# EAGLE design sensors (EAGLE 7.7.0)
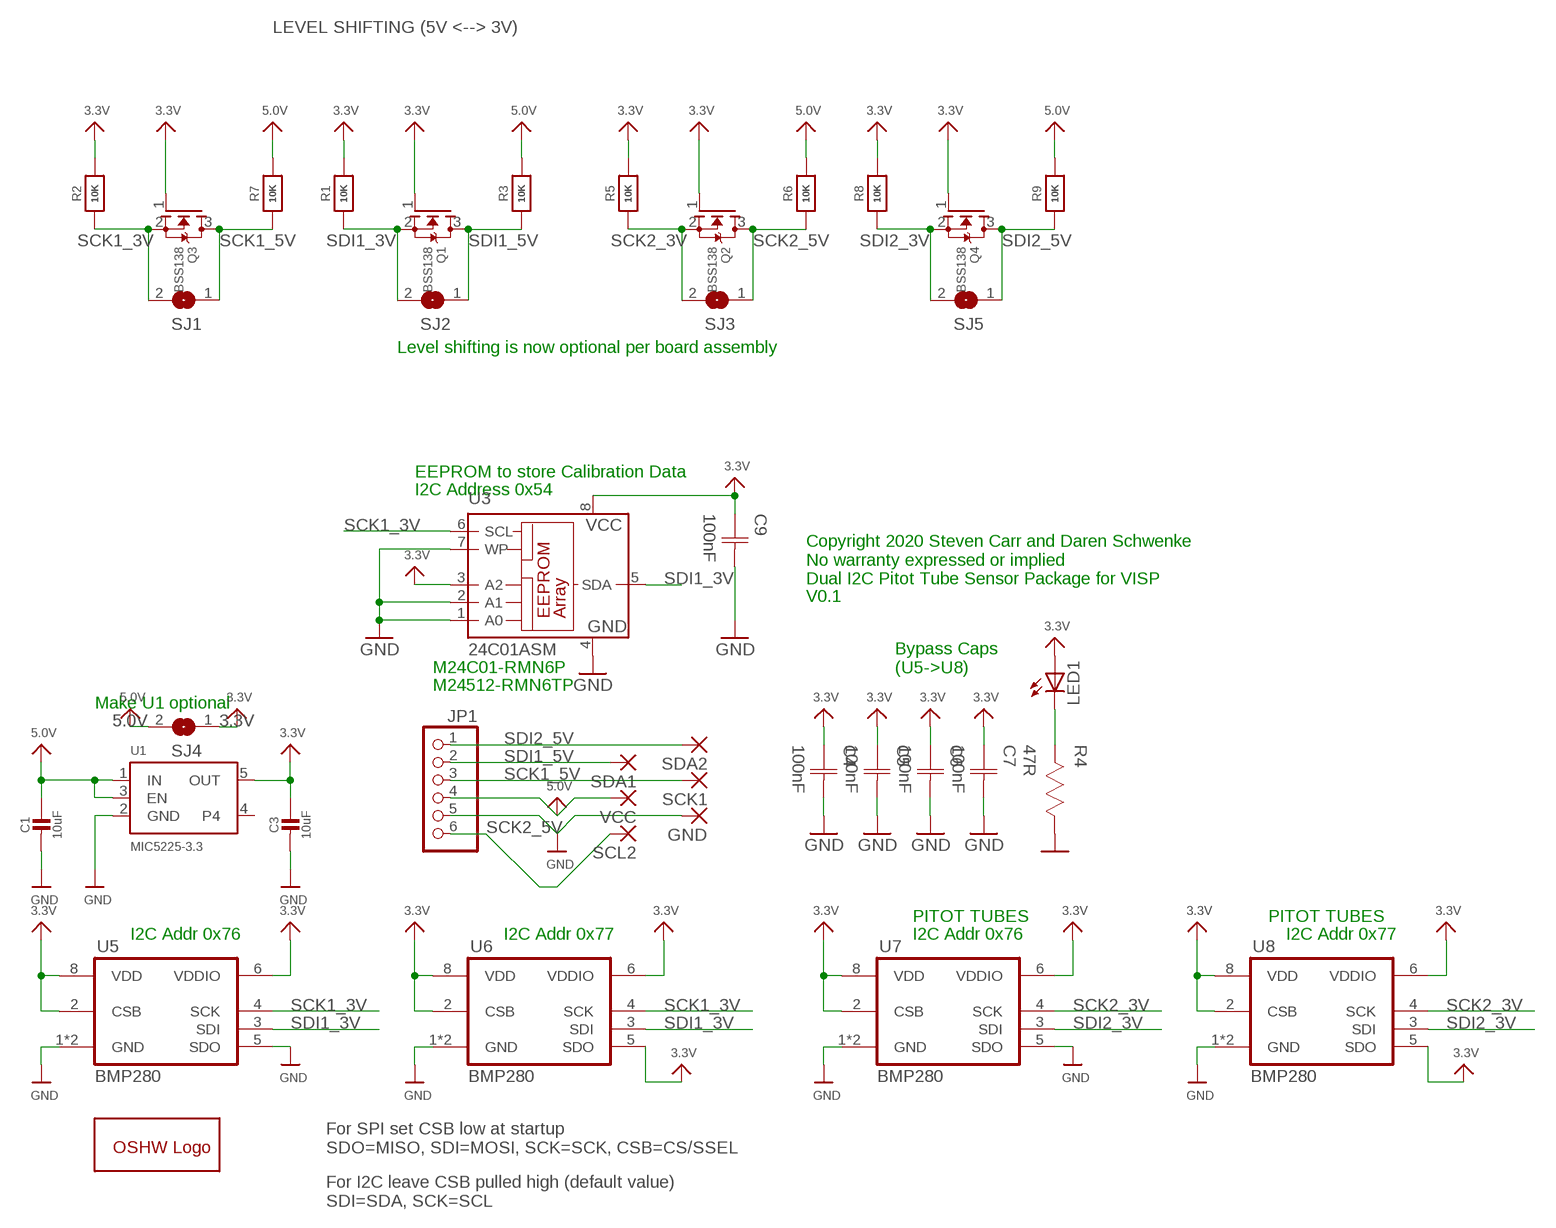
[diagram p0: schematic, sheet 1]

## Parts
C1  10uF  CAP_CERAMIC_0805  [_0805]
C3  10uF  CAP_CERAMIC_0805  [_0805]
C4  100nF  CAPACITOR-0402  [CAP0402]
C5  100nF  CAPACITOR-0402  [CAP0402]
C6  100nF  CAPACITOR-0402  [CAP0402]
C7  100nF  CAPACITOR-0402  [CAP0402]
C9  100nF  CAPACITOR-0402  [CAP0402]
GND  SMD2  [SMD1,27-2,54]
GOLD_ORB_SM1  OSHWLOGOLOGO8MM  [OSHW_8MM]
JP1  PINHD-1X6  [1X06]
LED1  LEDCHIP-LED0603  [CHIP-LED0603]
Q1  BSS138  MOSFET-NWIDE  [SOT23-WIDE]
Q2  BSS138  MOSFET-NWIDE  [SOT23-WIDE]
Q3  BSS138  MOSFET-NWIDE  [SOT23-WIDE]
Q4  BSS138  MOSFET-NWIDE  [SOT23-WIDE]
R1  10K  RESISTOR_0402  [_0402]
R2  10K  RESISTOR_0402  [_0402]
R3  10K  RESISTOR_0402  [_0402]
R4  47R  RESISTOR-0402  [RES0402]
R5  10K  RESISTOR_0402  [_0402]
R6  10K  RESISTOR_0402  [_0402]
R7  10K  RESISTOR_0402  [_0402]
R8  10K  RESISTOR_0402  [_0402]
R9  10K  RESISTOR_0402  [_0402]
SCK1  SMD2  [SMD1,27-2,54]
SCL2  SMD2  [SMD1,27-2,54]
SDA1  SMD2  [SMD1,27-2,54]
SDA2  SMD2  [SMD1,27-2,54]
SJ1  SJ  [SJ]
SJ2  SJ  [SJ]
SJ3  SJ  [SJ]
SJ4  SJ  [SJ]
SJ5  SJ  [SJ]
U1  MIC5225-3.3  VREG_SOT23-5  [SOT23-5]
U3  24C01ASM  [SO-08M]
U5  BMP280  [BMP280]
U6  BMP280  [BMP280]
U7  BMP280  [BMP280]
U8  BMP280  [BMP280]
VCC  SMD2  [SMD1,27-2,54]

## Nets
3.3V: C3.1 C4.1(C1) C5.1(C1) C6.1(C1) C7.1(C1) C9.1(C1) LED1.A Q1.1(G) Q2.1(G) Q3.1(G) Q4.1(G) R1.2 R2.2 R5.2 R8.2 SJ4.1 U1.5(OUT) U3.3(A2) U3.8(VCC) U5.2(CSB) U5.6(VDDIO) U5.8(VDD) U6.2(CSB) U6.5(SDO) U6.6(VDDIO) U6.8(VDD) U7.2(CSB) U7.6(VDDIO) U7.8(VDD) U8.2(CSB) U8.5(SDO) U8.6(VDDIO) U8.8(VDD)
5.0V: C1.1 JP1.4 R3.2 R6.2 R7.2 R9.2 SJ4.2 U1.1(IN) U1.3(EN) VCC.1(P)
GND: C1.2 C3.2 C4.2(C2) C5.2(C2) C6.2(C2) C7.2(C2) C9.2(C2) GND.1(P) JP1.5 R4.1 U1.2(GND) U3.1(A0) U3.2(A1) U3.4(GND) U3.7(WP) U5.1(GND) U5.5(SDO) U5.7(GND) U6.1(GND) U6.7(GND) U7.1(GND) U7.5(SDO) U7.7(GND) U8.1(GND) U8.7(GND)
LED: LED1.C R4.2
SCK1_3V: Q3.2(S) R2.1 SJ1.2 U3.6(SCL) U5.4(SCK) U6.4(SCK)
SCK1_5V: JP1.3 Q3.3(D) R7.1 SCK1.1(P) SJ1.1
SCK2_3V: Q2.2(S) R5.1 SJ3.2 U7.4(SCK) U8.4(SCK)
SCK2_5V: JP1.6 Q2.3(D) R6.1 SCL2.1(P) SJ3.1
SDI1_3V: Q1.2(S) R1.1 SJ2.2 U3.5(SDA) U5.3(SDI) U6.3(SDI)
SDI1_5V: JP1.2 Q1.3(D) R3.1 SDA1.1(P) SJ2.1
SDI2_3V: Q4.2(S) R8.1 SJ5.2 U7.3(SDI) U8.3(SDI)
SDI2_5V: JP1.1 Q4.3(D) R9.1 SDA2.1(P) SJ5.1
Unconnected: U1.4

## Notes on the sheet
- LEVEL SHIFTING (5V <--> 3V)
- Level shifting is now optional per board assembly
- EEPROM to store Calibration Data
- I2C Address 0x54
- Copyright 2020 Steven Carr and Daren Schwenke
  No warranty expressed or implied
  Dual I2C Pitot Tube Sensor Package for VISP
- V0.1
- M24C01-RMN6P
- Bypass Caps
  (U5->U8)
- M24512-RMN6TP
- Make U1 optional
- PITOT TUBES | PITOT TUBES
- I2C Addr 0x76 | I2C Addr 0x77 | I2C Addr 0x76 | I2C Addr 0x77
- For SPI set CSB low at startup
  SDO=MISO, SDI=MOSI, SCK=SCK, CSB=CS/SSEL
- For I2C leave CSB pulled high (default value)
  SDI=SDA, SCK=SCL

## Library data of the parts
C1 C3 = microbuilder:CAP_CERAMIC: Ceramic Capacitors For new designs, use the packages preceded by an '_' character since they are more reliable: The following footprints should be used on most boards: _0402 - Standard footprint for regular board layouts _0603 - Standard footprint for regular board layouts _0805 - Standard footprint for regular board layouts _1206 - Standard footprint for regular board layouts For extremely tight-pitch boards where space is at a premium, the following 'micro-pitch' footprints can be used (smaller pads, no silkscreen outline, etc.): _0402MP - Micro-pitch footprint for very dense/compact boards _0603MP - Micro-pitch footprint for very dense/compact boards _0805MP - Micro-pitch footprint for very dense/compact boards _1206MP - Micro-pitch footprint for very dense/compact boards; MPN: C1608X5R1A106M080AC
C4-C7 = Capacitor:CAPACITOR; MPN: CL10F104ZO8NNNC
C9 = Capacitor:CAPACITOR; MPN: CL10B104KB8NNNC
GND SCK1 SCL2 SDA1 SDA2 VCC = wirepad:SMD2: SMD PAD
GOLD_ORB_SM1 = oshw:OSHWLOGO: The OSHW logo for PCB layout
JP1 = pinhead:PINHD-1X6: PIN HEADER
LED1 = led:LED: LED OSRAM: - CHIPLED LG R971, LG N971, LY N971, LG Q971, LY Q971, LO R971, LY R971 LH N974, LH R974 LS Q976, LO Q976, LY Q976 LO Q996 - Hyper CHIPLED LW Q18S LB Q993, LB Q99A, LB R99A - SideLED LS A670, LO A670, LY A670, LG A670, LP A670 LB A673, LV A673, LT A673, LW A673 LH A674 LY A675 LS A676, LA A676, LO A676, LY A676, LW A676 LS A679, LY A679, LG A679 - Hyper Micro SIDELED® LS Y876, LA Y876, LO Y876, LY Y876 LT Y87S - SmartLED LW L88C, LW L88S LB L89C, LB L89S, LG L890 LS L89K, LO L89K, LY L89K LS L896, LA L896, LO L896, LY L896 - TOPLED LS T670, LO T670, LY T670, LG T670, LP T670 LSG T670, LSP T670, LSY T670, LOP T670, LYG T670 LG T671, LOG T671, LSG T671 LB T673, LV T673, LT T673, LW T673 LH T674 LS T676, LA T676, LO T676, LY T676, LB T676, LH T676, LSB T676, LW T676 LB T67C, LV T67C, LT T67C, LS T67K, LO T67K, LY T67K, LW E67C LS E67B, LA E67B, LO E67B, LY E67B, LB E67C, LV E67C, LT E67C LW T67C LS T679, LY T679, LG T679 LS T770, LO T770, LY T770, LG T770, LP T770 LB T773, LV T773, LT T773, LW T773 LH T774 LS E675, LA E675, LY E675, LS T675 LS T776, LA T776, LO T776, LY T776, LB T776 LHGB T686 LT T68C, LB T68C - Hyper Mini TOPLED® LB M676 - Mini TOPLED Santana® LG M470 LS M47K, LO M47K, LY M47K Source: http://www.osram.convergy.de LUXEON: - LUMILED® LXK2-PW12-R00, LXK2-PW12-S00, LXK2-PW14-U00, LXK2-PW14-V00 LXK2-PM12-R00, LXK2-PM12-S00, LXK2-PM14-U00 LXK2-PE12-Q00, LXK2-PE12-R00, LXK2-PE12-S00, LXK2-PE14-T00, LXK2-PE14-U00 LXK2-PB12-K00, LXK2-PB12-L00, LXK2-PB12-M00, LXK2-PB14-N00, LXK2-PB14-P00, LXK2-PB14-Q00 LXK2-PR12-L00, LXK2-PR12-M00, LXK2-PR14-Q00, LXK2-PR14-R00 LXK2-PD12-Q00, LXK2-PD12-R00, LXK2-PD12-S00 LXK2-PH12-R00, LXK2-PH12-S00 LXK2-PL12-P00, LXK2-PL12-Q00, LXK2-PL12-R00 Source: www.luxeon.com KINGBRIGHT: KA-3528ASYC Source: www.kingbright.com; MPN: SML-D12P8WT86
Q1-Q4 = microbuilder:MOSFET-N: N-Channel Mosfet LEGEND VDS: Voltage Drain-Source ID: Drain Current RDS(ON): Drain-Source On-State Resistance VGS(TH): Gate-Source Threshold Voltage CISS: Drain-Source Input Capacitance SOT-23 Name VDS ID RDS(ON) VGS(TH) CISS Order Number 2N7002E 60V 260mA 2.5 Ohm 2.5V @ 250uA 26.7pF @ 25V 2N7002ET1GOSTR-ND BSH103 30V 850mA 400 mOhm 400mV @ 1mA 83pF @ 24V BSH103,235-ND BSS138 60V 320mA 1.6 Ohm 1.5V @ 250uA 50pF @ 10V Mouser: 771-BSS138PW115 DMN2075U-7 20V 4.2A 38 mOhm 1V @ 250 uA 594.3pF @ 10V DMN2075U-7DICT-ND * BSS138 good choice for I2C level-shifting POWERPAK 1212-8 Name VDS ID RDS(ON) VGS(TH) CISS Order Number Si7308DN 60V 6A 58 mOhm 3V @ 250uA 665pF @ 15V SI7308DN-T1-E3CT-ND
R1-R3 R5-R9 = microbuilder:RESISTOR: Resistors For new designs, use the packages preceded by an '_' character since they are more reliable: The following footprints should be used on most boards: _0402 - Standard footprint for regular board layouts _0603 - Standard footprint for regular board layouts _0805 - Standard footprint for regular board layouts _1206 - Standard footprint for regular board layouts For extremely tight-pitch boards where space is at a premium, the following 'micro-pitch' footprints can be used (smaller pads, no silkscreen outline, etc.): _0402MP - Micro-pitch footprint for very dense/compact boards _0603MP - Micro-pitch footprint for very dense/compact boards _0805MP - Micro-pitch footprint for very dense/compact boards _1206MP - Micro-pitch footprint for very dense/compact boards
R4 = Resistor:RESISTOR; MPN: RC0603FR-0747RL
SJ1-SJ5 = jumper:SJ: SMD solder JUMPER
U1 = microbuilder:VREG_SOT23-5: SOT23-5 Fixed Voltage Regulators Part Current Out V Out V In V Dropout θJA (°C/W) TJ (°C) Digikey Part No. ADP121 150mA 3.3V 3.4-5.5V 0.09V @ 150mA -- -- ADP121-AUJZ33R7CT-ND ADP121 150mA 3.0V 3.1-5.5V 0.09V @ 150mA -- -- ADP121-AUJZ30R7CT-ND ADP122 300mA 3.3V 3.4-5.5V 0.085V @ 300mA -- -- ADP122AUJZ-3.3-R7CT-ND ADP1712 300mA 3.3V 3.5-5.5V 0.17V @ 300mA -- -- ADP1712AUJZ-3.3-R7TR-ND AP7311 (Low Cost) 150mA 3.3V 3.5-6V 0.15V @ 150mA -- -- AP7311-33WG-7DICT-ND LD39015M18R 150mA 1.8V 1.9V-5.5V 0.08V @ 100mA -- -- 497-6977-1-ND LP2985A-33DBVR 150mA 3.3V 3.3-16V 0.28V @ 150mA 206 150 296-18479-1-ND MCP1824T-3302E/OT 300mA 3.3V 3.5V-6V 0.2V @ 300mA -- -- MCP1824T-3302E/OTCT-ND MIC5205-2.5YM5 TR 150mA 2.5V 2.7-16V 0.165V @ 150mA -- -- 576-1257-2-ND MIC5205-3.0YM5 TR 150mA 3.0V 3.2V-16V 0.165V @ 150mA -- -- 576-1258-2-ND MIC5205-3.3YM5 TR 150mA 3.3V 3.5V-16V 0.165V @ 150mA -- -- 576-1259-2-ND TPS780330220 150mA 3.3V+2.2V 3.6-5.5V 250mV Max -- -- 296-23332-1-ND TDA3663/N1,135 100mA 3.3V 3.5-45V 0.18V @ 50mA -- -- 568-5343-1-ND Max operating temp can be calculated using θJA, TJ (max junction temperature), and power in watts. Set the "Maximum Ambient Temperature" until it reaches TJ ("Max Junction Temperature"), which is the absolute limit for safe use of the regulator: Heat Sink Temperature Calculator <http://www.daycounter.com/Calculators/Heat-Sink-Temperature-Calculator.phtml> For example, With 12V source into a 3.3V LP2985 and a 30mA load, we are dissipating (12V-3.3V) * 0.03A = 0.261W. With a θJA of 206 °C/W, a TJ of 150°C, and 261mW we can safely use the chip without a heat sink up to 75°C (=147.1°C Junction Temperature).; MPN: MIC5225-3.3YM5-TR
U3 = microchip:24*: Serial EEPROM I2C; MF: MICROCHIP; MPN: M24C01-RMN6P
U5-U8 = bosch-bmp280:BMP280: The BMP280 is an absolute barometric pressure sensor especially designed for mobile applications. The sensor module is housed in an extremely compact 8-pin metal-lid LGA package with a footprint of only 2.0 × 2.5 mm2 and 0.95 mm package height. Its small dimensions and its low power consumption of 2.7 μA @1Hz allow the implementation in battery driven devices such as mobile phones, GPS modules or watches. The library has been designed by Richard Magdycz <https://www.facebook.com/groups/eaglecadsoftUK>; MPN: BMP280

## Board
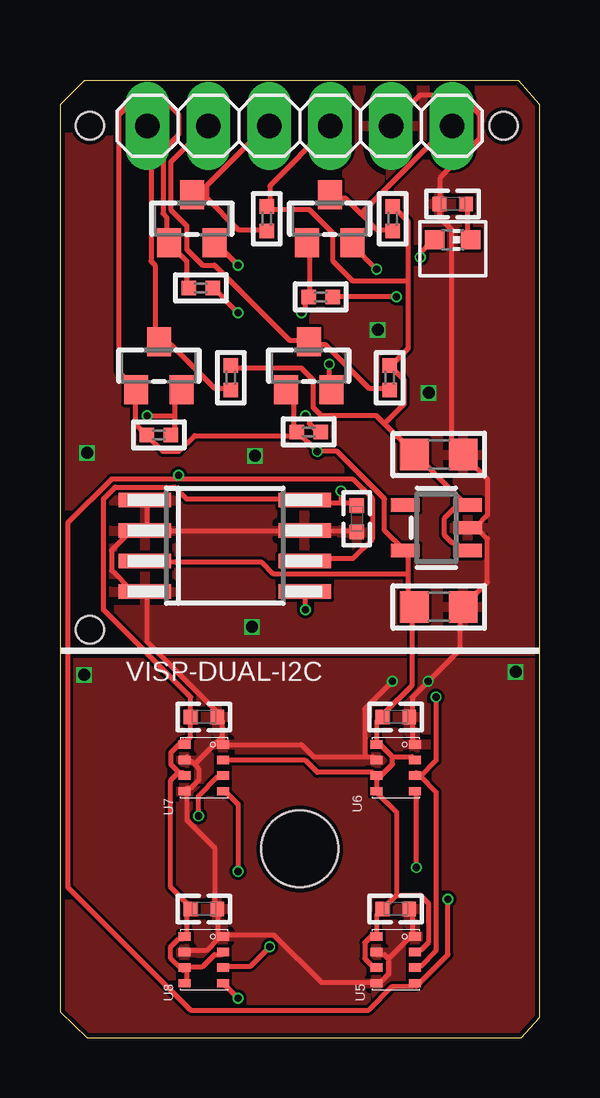
[diagram p1: board, top side]
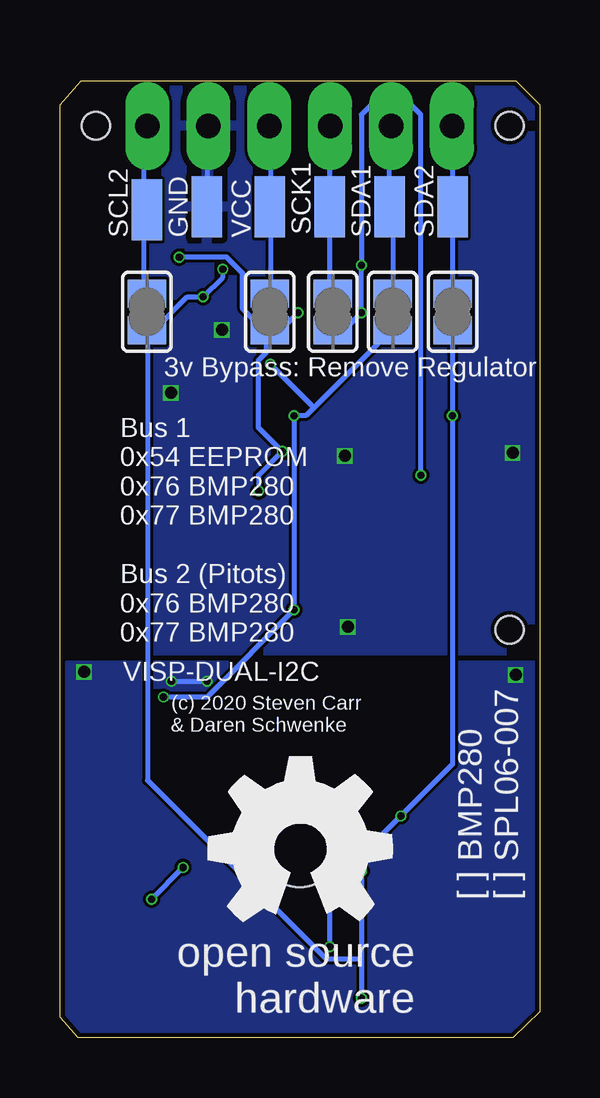
[diagram p2: board, bottom side, seen from below]

Size 20 x 39.88 mm. Coordinates in mm from the lower left corner, seen from the top.
Outline: 1,39.88 0,38.88 0,1.08 1.12,0 19.23,0 20,0.85 20,38.88 19.12,39.88 1,39.88
Copper layers (1*16): Top 0.035mm / dielectric 1.6mm / Bottom 0.035mm
Design rules "jlcpcb-2layers *": minimum track width 8mil, minimum drill 0.3mm, track to track 5mil, track to pad 5mil, pad to pad 5mil, via to via 5mil, smd to smd 5mil, copper to edge 0.2mm, drill to drill 6mil, minimum pad ring 10mil, minimum via ring 3mil, stop-mask expansion 4mil, vias tented up to drill 0mil, thermal gap 10mil
Holes 3.2 mm at 10,7.88
Holes 1.15 mm at 18.5,38 1.25,17 1.25,38
vRestrict: area 4.8,2.8 to 7.2,5.2; area 12.8,2.8 to 15.2,5.2; area 4.8,10.8 to 7.2,13.2; area 12.8,10.8 to 15.2,13.2

### Footprints (pad centres in the part's own frame; a part is rotated, then mirrored left to right if it is on the bottom)
_0805 = smd 1.2 x 1.3: 1 -1.016,0; 2 1.016,0
CAP0402 = smd 0.6 x 0.6: 1 -0.55,0; 2 0.55,0
SMD1,27-2,54 = smd 1.27 x 2.54: 1 0,0
1X06 = drill 1.016 long: 1 -6.35,0; 2 -3.81,0; 3 -1.27,0; 4 1.27,0; 5 3.81,0; 6 6.35,0
CHIP-LED0603 = smd 0.8 x 0.8: A 0,-0.75; C 0,0.75
SOT23-WIDE = smd 1 x 1.2: 1 -0.95,-1; 2 0.95,-1; 3 0,1
_0402 = smd 0.6 x 0.6: 1 -0.508,0; 2 0.508,0
RES0402 = smd 0.6 x 0.6: 1 -0.55,0; 2 0.55,0
SJ = smd 1.168 x 1.6: 1 -0.762,0; 2 0.762,0
SOT23-5 = smd 0.55 x 1.2: 1 -0.95,-1.3; 2 0,-1.3; 3 0.95,-1.3; 4 0.95,1.3; 5 -0.95,1.3
SO-08M = smd 0.6 x 2.2: 1 -1.905,-3.33; 2 -0.635,-3.33; 3 0.635,-3.33; 4 1.905,-3.33; 5 1.905,3.33; 6 0.635,3.33; 7 -0.635,3.33; 8 -1.905,3.33
BMP280 = smd 0.35 x 0.5: 1 0.975,-0.8; 2 0.325,-0.8; 3 -0.325,-0.8; 4 -0.975,-0.8; 5 -0.975,0.8; 6 -0.325,0.8; 7 0.325,0.8; 8 0.975,0.8

### Placement (x,y rotation side)
C1  15.8,24.3 0 top
C3  15.8,17.95 0 top
C4  6,13.38 0 top
C5  14,5.38 0 top
C6  6,5.38 0 top
C7  14,13.38 0 top
C9  12.38,21.62 270 top
GND  13.88,34.62 0 bottom
GOLD_ORB_SM1  10,7.88 0 bottom
JP1  10,38 0 top
LED1  16.38,33.25 270 top
Q1  10.38,28 0 top
Q2  11.25,34.12 0 top
Q3  5.5,34.12 0 top
Q4  4.12,28 0 top
R1  10.38,25.25 180 top
R2  5.88,31.25 180 top
R3  13.75,27.5 90 top
R4  16.38,34.75 0 top
R5  10.88,30.88 180 top
R6  13.88,34.12 90 top
R7  8.62,34.12 90 top
R8  4.12,25.12 180 top
R9  7.12,27.5 90 top
SCK1  8.75,34.62 0 bottom
SCL2  16.38,34.5 0 bottom
SDA1  6.25,34.62 0 bottom
SDA2  3.62,34.62 0 bottom
SJ1  8.62,30.25 270 bottom
SJ2  6.12,30.25 270 bottom
SJ3  16.38,30.25 270 bottom
SJ4  11.25,30.25 90 bottom
SJ5  3.62,30.25 270 bottom
U1  15.7,21.25 90 top
U3  6.88,20.5 270 top
U5  14,3.25 90 top
U6  14,11.25 90 top
U7  6,11.25 90 top
U8  6,3.25 90 top
VCC  11.25,34.62 0 bottom

### Tracks (layer width: path | path; a pad name or v marks a point on that pad's centre or on a via)
3.3V  (via drill 0.3)
  Top 0.203: 11.72,22.29 10.24,22.29 U3.8 10.07,22.45 5.28,22.45 4.79,22.95 2.31,22.95 1.82,22.45 1.82,17.83 5.45,14.2 5.45,13.54 C4.1 5.45,12.55 5.28,12.38 U7.8 5.12,12.38 4.62,11.89 4.62,11.39 4.95,11.06 | 11.72,22.29 12.22,22.29 C9.1 | 4.95,11.06 5.12,11.06 U7.6 4.95,11.06 | U8.5 5.28,2.31 5.28,2.81 U8.6 | U8.2 6.77,3.47 6.44,3.47 5.94,2.97 5.28,2.97 U8.6 | U8.6 5.12,2.81 4.62,3.3 4.62,3.8 4.95,4.13 5.12,4.13 U8.8 5.28,4.29 5.28,5.12 5.45,5.28 C6.1 5.45,5.45 4.62,6.27 4.62,10.73 4.95,11.06 | Q2.1 10.4,33.02 10.4,31.04 R5.2 10.24,30.87 10.24,30.38 v10.07,30.21 | v15.02,32.52 15.02,32.69 15.52,33.19 LED1.A | R2.2 5.28,31.37 5.28,32.36 4.62,33.02 Q3.1 4.46,33.19 4.46,34.18 4.29,34.34 4.29,36.98 4.95,37.64 4.95,38.47 4.13,39.29 3.3,39.29 2.48,38.47 2.48,27.74 3.14,27.08 Q4.1 3.14,26.91 3.14,25.59 3.47,25.26 R8.2 3.63,25.09 4.29,24.43 4.95,24.43 5.61,25.09 9.74,25.09 R1.2 | R1.2 9.74,25.26 9.74,26.75 9.58,26.91 Q1.1 | R1.2 9.91,25.26 v10.73,24.43 11.56,24.43 13.54,22.45 13.54,21.13 14.36,20.31 U1.5 14.53,20.14 14.53,19.32 | 14.53,19.32 14.53,18.16 14.69,18 C3.1 14.69,17.83 14.69,14.69 13.54,13.54 C7.1 13.37,13.37 13.21,13.21 13.21,12.38 | U5.6 13.04,2.97 12.71,3.3 12.71,3.96 13.04,4.29 U5.8 13.21,4.29 13.21,5.12 13.37,5.28 C5.1 13.54,5.45 14.03,5.94 | 14.03,5.94 15.02,5.94 15.35,5.61 15.35,3.96 15.02,3.63 14.86,3.63 U5.2 | 13.87,11.72 14.69,11.72 U6.2 | 13.21,12.38 13.87,11.72 | 13.21,12.38 U6.8 | 13.21,10.73 13.21,10.9 U6.6 13.04,11.06 10.73,11.06 10.24,11.56 6.93,11.56 U7.2 | 13.21,10.73 13.21,10.4 U6.5 13.21,10.24 14.03,9.41 14.03,5.94 | 13.87,11.72 13.87,11.39 13.21,10.73
  Top 0.203: 14.53,19.32 8.91,19.32 8.42,19.81 3.63,19.81 U3.3 | v11.72,22.78 11.72,22.29
  Bottom 0.203: v15.02,32.52 13.04,32.52 12.38,31.86 12.38,30.38 11.39,29.39 | v10.07,30.21 10.73,29.55 11.23,29.55 SJ4.1 11.39,29.39 | 11.39,29.39 11.39,28.56 11.72,28.23 11.72,25.43 v10.73,24.43 11.72,23.44 v11.72,22.78
5.0V
  Top 0.203: JP1.4 11.23,37.97 8.75,35.5 8.75,34.67 R7.2 8.75,34.51 10.4,34.51 11.39,33.52 11.39,32.36 12.22,31.53 14.53,31.53 | U1.1 16.84,20.31 16.51,20.64 16.34,20.64 16.02,20.97 16.02,21.63 16.51,22.12 16.84,22.12 U1.3 16.84,22.29 14.86,24.27 C1.1 14.69,24.43 13.54,25.59 | 13.54,25.59 13.21,25.92 10.9,25.92 10.57,26.25 10.57,27.41 10.07,27.9 7.26,27.9 R9.2 | 13.54,25.59 14.36,26.42 14.36,27.41 13.87,27.9 R3.2 13.87,28.07 14.53,28.73 14.53,31.53 | 14.53,31.53 14.53,34.01 14.03,34.51 R6.2
  Bottom 0.203: SJ4.2 11.23,31.04 11.23,34.51 VCC.1 11.23,34.67 11.23,37.97 JP1.4
GND  (via drill 0.3, 0.5 pad 0.25)
  Top 0.203: C9.2 12.22,21.13 10.24,21.13 U3.7 10.07,21.13 3.63,21.13 U3.2 | U3.2 3.47,21.13 2.97,21.13 2.15,20.31 2.15,19.48 2.97,18.66 3.47,18.66 U3.4 3.63,18.49 3.63,16.51 6.6,13.54 C4.2 6.6,13.37 6.77,13.21 6.77,12.55 | U3.1 3.63,22.29 3.63,21.3 U3.2 | 13.7,3.3 13.7,2.64 13.37,2.31 13.21,2.31 U5.5 13.04,2.31 10.9,2.31 8.91,4.29 6.93,4.29 U8.1 | 13.7,3.3 13.54,3.47 13.21,3.47 U5.7 | 14.69,4.29 14.69,5.28 C5.2 | 14.69,4.29 13.7,3.3 | 14.69,4.29 U5.1 | 6.6,4.13 6.77,4.29 U8.1 | 6.6,4.13 6.11,3.63 5.28,3.63 U8.7 | 6.6,4.13 6.6,5.28 C6.2 6.44,5.45 6.44,7.92 5.28,9.08 5.28,10.24 U7.5 5.28,10.4 5.45,10.4 5.78,10.73 5.78,11.23 5.61,11.39 | 6.6,4.13 U8.1 | 5.61,11.39 5.28,11.72 U7.7 | 6.77,12.55 6.77,12.38 U7.1 6.93,12.22 10.07,12.22 10.57,11.72 12.71,11.72 | 12.71,11.72 13.04,11.72 U6.7 | 6.77,12.55 5.61,11.39 | JP1.5 13.87,38.14 15.02,39.29 16.68,39.29 17.5,38.47 17.5,37.48 15.85,35.83 15.85,34.84 R4.1 15.85,34.67 15.85,34.18 16.34,33.68 16.34,24.77 16.68,24.43 C1.2 16.84,24.27 17.83,23.28 17.83,21.79 17.34,21.3 | 17.34,21.3 17,21.3 U1.2 17.34,21.3 | U6.1 14.69,12.38 14.69,13.37 C7.2 14.69,13.54 14.69,14.2 v15.35,14.86 16.68,16.18 16.68,17.83 C3.2 16.84,18 17.83,18.99 17.83,20.8 17.34,21.3 | 12.71,11.72 12.71,13.7 v13.87,14.86
  Bottom 0.203: GND.1 13.87,34.67 13.87,37.97 JP1.5 | v15.35,14.86 v13.87,14.86
  other vias: 19,15.25 1,15.12 8,17.12 8.12,24.25 1.12,24.38 15.38,26.88 13.25,29.5
  pour Top: 0,38.75 0,16.12 19.88,16.12 19.88,39 19.12,39.75 0.88,39.75 0.88,39.62
  pour Bottom: 0,38.88 0,16.12 19.88,16.12 19.88,39.12 19.25,39.75 0.88,39.75
  pour Bottom: 0,15.5 19.75,15.5 19.75,0.62 19.25,0.12 0.75,0.12 0,0.88
  pour Top: 0,15.62 19.88,15.62 19.88,0.75 19.25,0.12 0.88,0.12 0,1
LED
  Top 0.203: R4.2 17,34.67 17,33.35 LED1.C
SCK1_3V  (via drill 0.3)
  Top 0.203: v7.43,30.21 6.44,31.2 R2.1 | v7.43,32.19 6.6,33.02 Q3.2 | 4.95,23.28 12.22,23.28 13.04,22.45 13.04,20.8 12.22,19.98 10.24,19.98 U3.6 | 4.95,23.28 2.15,23.28 0.33,21.46 0.33,6.27 5.45,1.16 12.88,1.16 13.87,2.15 14.69,2.15 U5.4 14.86,2.15 16.18,3.47 v16.18,5.78 | v14.86,7.1 14.86,10.24 U6.4 | 4.95,23.28 v4.95,23.44
  Bottom 0.203: SJ1.2 8.59,29.55 8.09,29.55 v7.43,30.21 v7.43,32.19 7.43,38.47 6.6,39.29 5.78,39.29 4.95,38.47 v4.95,23.44 | v16.18,5.78 v14.86,7.1
SCK1_5V
  Top 0.203: 6.11,35 7.43,33.68 8.59,33.68 R7.1 | 6.11,35 5.61,35 Q3.3 | 6.11,35 6.11,35.5 8.59,37.97 JP1.3
  Bottom 0.203: SJ1.1 8.75,31.04 8.75,34.51 SCK1.1 8.75,34.67 8.75,37.97 JP1.3
SCK2_3V  (via drill 0.3)
  Top 0.203: v7.43,1.65 6.93,2.15 U8.4 | v7.43,6.93 7.43,9.74 6.93,10.24 U7.4 | v14.03,30.87 11.39,30.87 R5.1 | v13.21,32.03 12.22,33.02 Q2.2
  Bottom 0.203: v7.43,6.93 7.43,3.3 | 7.43,3.3 v7.43,1.65 | v13.21,32.03 13.21,31.7 v14.03,30.87 14.69,30.87 16.02,29.55 16.34,29.55 SJ3.2 16.34,29.39 16.34,10.73 8.91,3.3 7.43,3.3
SCK2_5V
  Top 0.203: 12.55,34.34 11.89,35 11.39,35 Q2.3 | 12.55,34.34 13.21,33.68 13.87,33.68 R6.1 | 12.55,34.34 16.34,38.14 JP1.6
  Bottom 0.203: SJ3.1 16.51,31.04 16.51,34.34 SCL2.1 16.51,34.51 16.51,37.97 JP1.6
SDI1_3V  (via drill 0.3)
  Top 0.203: 15.02,10.9 14.86,11.06 U6.3 15.02,10.9 | 15.02,10.9 15.68,10.24 15.68,3.63 15.02,2.97 14.86,2.97 U5.3 | v10.24,25.92 10.4,25.76 10.4,25.59 10.73,25.26 R1.1 | v11.23,28.07 11.23,27.08 Q1.2 | v10.24,17.83 10.24,18.49 U3.5 | 15.02,10.9 15.68,11.56 v15.68,14.2
  Bottom 0.203: 9.41,26.25 6.27,29.39 SJ2.2 | 9.41,26.25 9.74,25.92 v10.24,25.92 v10.24,17.83 13.87,14.2 v15.68,14.2 | 9.41,26.25 v11.23,28.07
SDI1_5V
  Top 0.203: R3.1 13.7,27.08 12.88,27.08 11.06,28.89 10.4,28.89 Q1.3 10.24,29.06 9.58,29.06 6.44,32.19 5.94,32.19 5.28,32.85 5.28,33.85 4.62,34.51 4.62,36.49 6.11,37.97 JP1.2
  Bottom 0.203: SJ2.1 6.11,31.04 6.11,34.51 SDA1.1 6.27,34.67 6.27,37.97 JP1.2
SDI2_3V  (via drill 0.3)
  Top 0.203: 4.79,25.92 4.79,26.75 4.95,26.91 Q4.2 | 4.79,25.92 4.79,25.26 R8.1 | v8.75,3.8 7.92,2.97 6.93,2.97 U8.3 | v5.78,9.25 5.78,10.07 6.6,10.9 6.77,10.9 U7.3 | v3.63,25.92 4.79,25.92
  Bottom 0.203: v8.75,3.8 8.75,6.27 v5.78,9.25 3.63,11.39 v3.63,25.92 3.63,29.39 SJ5.2
SDI2_5V
  Top 0.203: R9.1 7.1,27.08 6.44,27.08 4.62,28.89 4.13,28.89 Q4.3 3.96,29.06 3.96,32.19 3.8,32.36 3.8,37.97 JP1.1
  Bottom 0.203: SJ5.1 3.63,31.04 3.63,34.51 SDA2.1 3.63,34.67 3.63,37.97 JP1.1

### Text on the board
tNames: VISP-DUAL-I2C
bNames: 3v Bypass: Remove Regulator | Bus 1 / 0x54 EEPROM / 0x76 BMP280 / 0x77 BMP280 / / Bus 2 (Pitots) / 0x76 BMP280 / 0x77 BMP280 | VISP-DUAL-I2C | (c) 2020 Steven Carr / & Daren Schwenke | [ ] BMP280 / [ ] SPL06-007
tValues: -I>I- | EEPROM | 10uF | 10uF